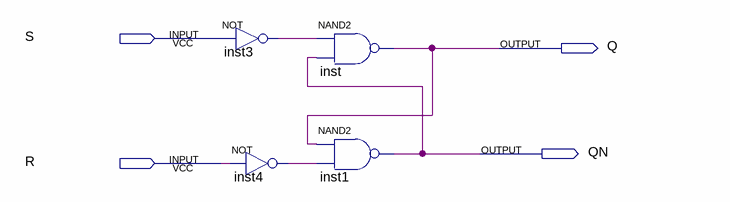
[diagram p0: schematic sheet]
// Quartus schematic lab9step1b.bdf as structural Verilog: 4 symbols, 4 pins
module lab9step1b (
  input  S,
  input  R,
  output Q,
  output QN
);

  wire inst3_out, inst4_out;

  not inst3 (inst3_out, S);
  not inst4 (inst4_out, R);
  nand inst (Q, inst3_out, QN);
  nand inst1 (QN, Q, inst4_out);
endmodule
